# Altium schematic sheet Sheet1.SchDoc
size A3; DocumentNumber: 1; SheetNumber: 1; SheetTotal: 1
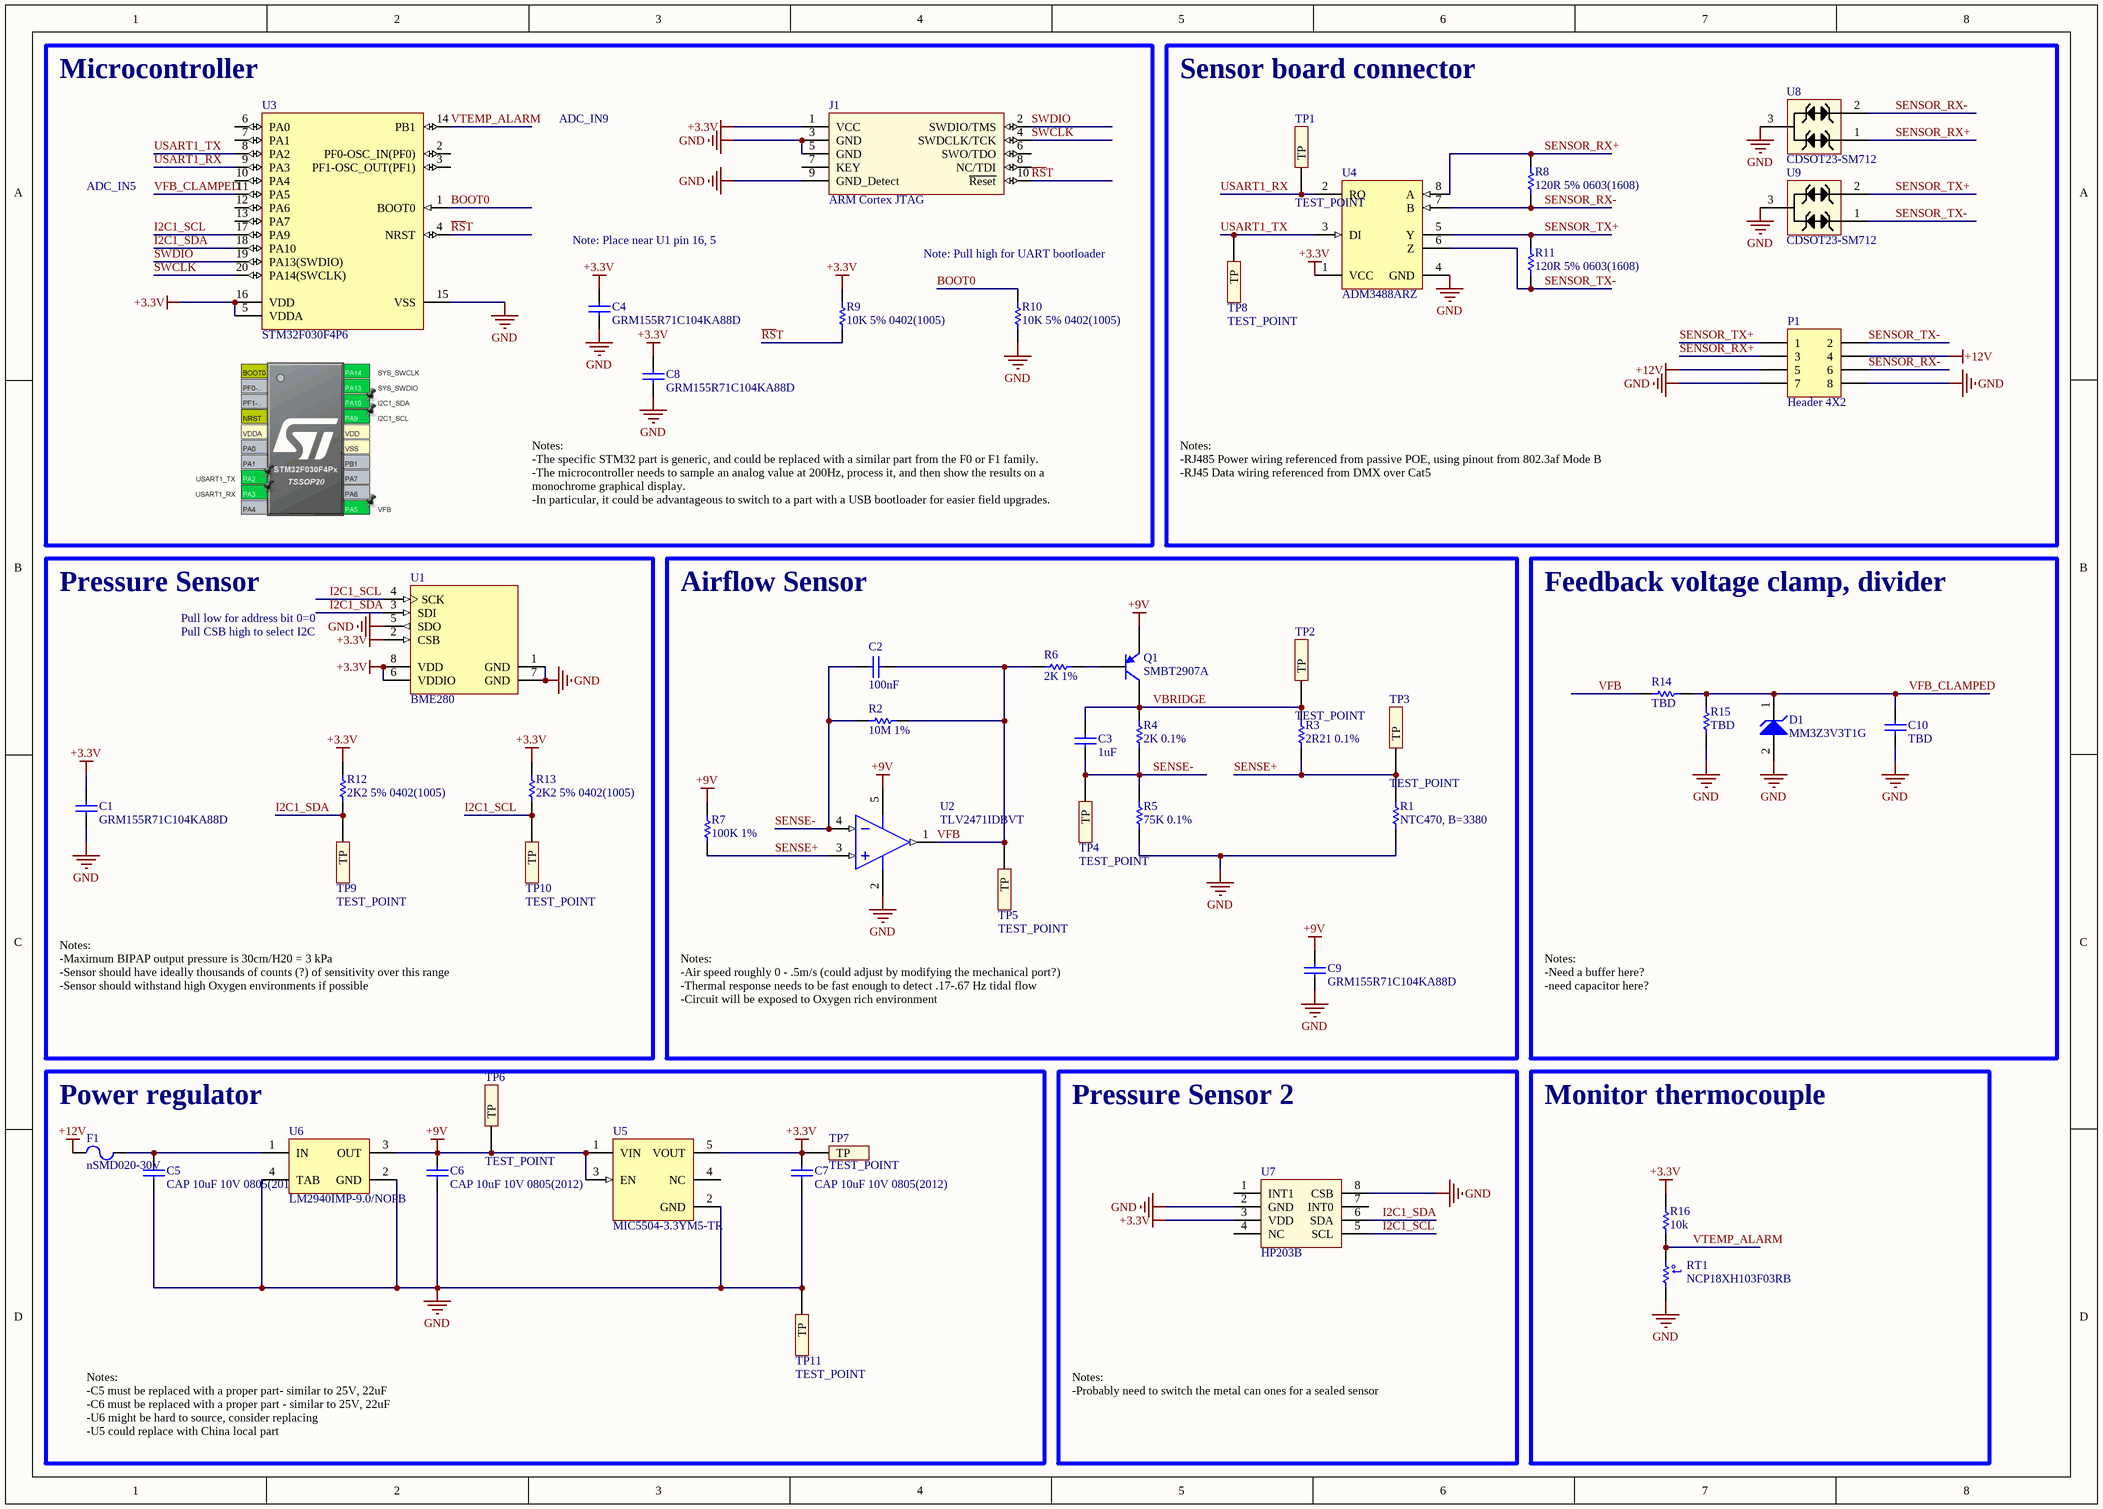
[diagram p0: Sheet1.SchDoc]

## Parts
C1  GRM155R71C104KA88D  [CAPC1005X55X25ML05T10]
C2  100nF  [CAPC1005X55X25ML05T10]
C3  1uF  [CAPC1005X55X25ML05T10]
C4  GRM155R71C104KA88D  [CAPC1005X55X25ML05T10]
C5  CAP 10uF 10V 0805(2012)  [CAPC0805(2012)145_N]
C6  CAP 10uF 10V 0805(2012)  [CAPC0805(2012)145_N]
C7  CAP 10uF 10V 0805(2012)  [CAPC0805(2012)145_N]
C8  GRM155R71C104KA88D  [CAPC1005X55X25ML05T10]
C9  GRM155R71C104KA88D  [CAPC1005X55X25ML05T10]
C10  TBD  [CAPC1005X55X25ML05T10]
D1  MM3Z3V3T1G  [ONSC-SOD-323-2-477-02_V]
F1  nSMD020-30V  [SEAANDLAND_1206]
J1  ARM Cortex JTAG  [1.27mm 2x5 SMD Header - no paste]
P1  Header 4X2  [HDR2X4]
Q1  SMBT2907A  [INF-SOT23_N]
R1  NTC470, B=3380  [RESC1005X40X25NL05T05]
R2  10M 1%  [RESC1005X40X25ML05T10]
R3  2R21 0.1%  [RESC1005X40X25ML05T10]
R4  2K 0.1%  [RESC1005X40X25ML05T10]
R5  75K 0.1%  [RESC1005X40X25ML05T10]
R6  2K 1%  [RESC1005X40X25NL05T05]
R7  100K 1%  [RESC1005X40X25ML05T10]
R8  120R 5% 0603(1608)  [RESC0603(1608)_L]
R9  10K 5% 0402(1005)  [RESC0402(1005)_N]
R10  10K 5% 0402(1005)  [RESC0402(1005)_N]
R11  120R 5% 0603(1608)  [RESC0603(1608)_L]
R12  2K2 5% 0402(1005)  [RESC0402(1005)_N]
R13  2K2 5% 0402(1005)  [RESC0402(1005)_N]
R14  TBD  [RESC1005X40X25ML05T10]
R15  TBD  [RESC1005X40X25ML05T10]
R16  10k  [RESC1005X40X25ML05T10]
RT1  NCP18XH103F03RB  [MURA-NCP18XH103F03RB-2_V]
TP1  TEST_POINT  [TP-SMD-1mm]  (no BOM)
TP2  TEST_POINT  [TP-SMD-1mm]  (no BOM)
TP3  TEST_POINT  [TP-SMD-1mm]  (no BOM)
TP4  TEST_POINT  [TP-SMD-1mm]  (no BOM)
TP5  TEST_POINT  [TP-SMD-1mm]  (no BOM)
TP6  TEST_POINT  [TP-SMD-1mm]  (no BOM)
TP7  TEST_POINT  [TP-SMD-1mm]  (no BOM)
TP8  TEST_POINT  [TP-SMD-1mm]  (no BOM)
TP9  TEST_POINT  [TP-SMD-1mm]  (no BOM)
TP10  TEST_POINT  [TP-SMD-1mm]  (no BOM)
TP11  TEST_POINT  [TP-SMD-1mm]  (no BOM)
U1  BME280  [BOSC-BME280-8_V]
U2  TLV2471IDBVT  [DBV0005A_L]
U3  STM32F030F4P6  [STM-TSSOP20_L]
U4  ADM3488ARZ  [ADI-R-8_L]
U5  MIC5504-3.3YM5-TR  [MCHP-SOT-23-M5_V]
U6  LM2940IMP-9.0/NOPB  [DCY0004A_L]
U7  HP203B  [HP203B]
U8  CDSOT23-SM712  [SOT95P230X117-3N]
U9  CDSOT23-SM712  [SOT95P230X117-3N]

## Blocks framed on the sheet
Microcontroller: C4 C8 J1 R9 R10 U3
Sensor board connector: P1 R8 R11 TP1 TP8 U4 U8 U9
Pressure Sensor: C1 R12 R13 TP9 TP10 U1
Airflow Sensor: C2 C3 C9 Q1 R1-R7 TP2-TP5 U2
Feedback voltage clamp, divider: C10 D1 R14 R15
Power regulator: C5-C7 F1 TP6 TP7 TP11 U5 U6
Pressure Sensor 2: U7
Monitor thermocouple: R16 RT1

## Nets
+3.3V: C1.2 C4.2 C7.2 C8.2 J1.1(VCC) R9.1 R12.2 R13.2 R16.1 TP7.1(TP) U1.2(CSB) U1.6(VDDIO) U1.8(VDD) U3.5(VDDA) U3.16(VDD) U4.1(VCC) U5.5(VOUT) U7.3(VDD)
+9V: C6.2 C9.2 Q1.2(E) R7.1 TP6.1(TP) U2.5(VDD) U5.1(VIN) U5.3(EN) U6.3(OUT)
+12V: F1.1 P1.4 P1.5
GND: C1.1 C4.1 C5.1 C6.1 C7.1 C8.1 C9.1 C10.2 D1.2(A) J1.3(GND) J1.5(GND) J1.9(GND_Detect) P1.7 P1.8 R1.1 R5.1 R10.2 R15.2 RT1.1 TP11.1(TP) U1.1(GND) U1.5(SDO) U1.7(GND) U2.2(GND) U3.15(VSS) U4.4(GND) U5.2(GND) U6.2(GND) U6.4(TAB) U7.2(GND) U7.8(CSB) U8.3 U9.3
~{RS}T: J1.10(~{Reset}) R9.2 U3.4(NRST)
BOOT0: R10.1 U3.1(BOOT0)
I2C1_SCL: R13.1 TP10.1(TP) U1.4(SCK) U3.17(PA9) U7.5(SCL)
I2C1_SDA: R12.1 TP9.1(TP) U1.3(SDI) U3.18(PA10) U7.6(SDA)
SENSE+: R1.2 R3.1 R7.2 TP3.1(TP) U2.3(IN+)
SENSE-: C2.2 C3.2 R2.2 R4.1 R5.2 TP4.1(TP) U2.4(IN-)
SENSOR_RX+: P1.3 R8.2 U4.8(A) U8.1
SENSOR_RX-: P1.6 R8.1 U4.7(B) U8.2
SENSOR_TX+: P1.1 R11.2 U4.5(Y) U9.2
SENSOR_TX-: P1.2 R11.1 U4.6(Z) U9.1
SWCLK: J1.4(SWDCLK/TCK) U3.20(PA14(SWCLK))
SWDIO: J1.2(SWDIO/TMS) U3.19(PA13(SWDIO))
USART1_RX: TP1.1(TP) U3.9(PA3) U4.2(RO)
USART1_TX: TP8.1(TP) U3.8(PA2) U4.3(DI)
VBRIDGE: C3.1 Q1.3(C) R3.2 R4.2 TP2.1(TP)
VFB: C2.1 R2.1 R6.2 R14.2 TP5.1(TP) U2.1(OUT)
VFB_CLAMPED: C10.1 D1.1(K) R14.1 R15.1 U3.11(PA5)
VTEMP_ALARM: R16.2 RT1.2 U3.14(PB1)
NetC5_2: C5.2 F1.2 U6.1(IN)
NetQ1_1: Q1.1(B) R6.1

Not connected (* = marked no-connect by the designer): J1 6(SWO/TDO) 7(KEY) 8(NC/TDI); U3 2(PF0-OSC_IN(PF0)) 3(PF1-OSC_OUT(PF1)) 6(PA0) 7(PA1) 10(PA4) 12(PA6) 13(PA7); U5 4(NC); U7 1(INT1) 4(NC) 7(INT0)

## Notes on the sheet
- ADC_IN9
- ADC_IN5
- Note: Place near U1 pin 16, 5
- (near R10) Note: Pull high for UART bootloader
- Notes:
  -The specific STM32 part is generic, and could be replaced with a similar part from the F0 or F1 family.
  -The microcontroller needs to sample an analog value at 200Hz, process it, and then show the results on a monochrome graphical display.
  -In particular, it could be advantageous to switch to a part with a USB bootloader for easier field upgrades.
- Notes:
  -RJ485 Power wiring referenced from passive POE, using pinout from 802.3af Mode B
  -RJ45 Data wiring referenced from DMX over Cat5
- Pull CSB high to select I2C
- Pull low for address bit 0=0
- Notes:
  -Maximum BIPAP output pressure is 30cm/H20 = 3 kPa
  -Sensor should have ideally thousands of counts (?) of sensitivity over this range
  -Sensor should withstand high Oxygen environments if possible
- Notes:
  -Air speed roughly 0 - .5m/s (could adjust by modifying the mechanical port?)
  -Thermal response needs to be fast enough to detect .17-.67 Hz tidal flow
  -Circuit will be exposed to Oxygen rich environment
- Notes:
  -Need a buffer here?
  -need capacitor here?
- Notes:
  -C5 must be replaced with a proper part- similar to 25V, 22uF
  -C6 must be replaced with a proper part - similar to 25V, 22uF
  -U6 might be hard to source, consider replacing
  -U5 could replace with China local part
- Notes:
  -Probably need to switch the metal can ones for a sealed sensor
- Title:
- Project:
- Revision:
- Date:
- Time:
- Sheet
- of
- (in symbol CMP-2000-05271-1) t°

## Library data of the parts
C1 C3 C4 C8-C10 = CMP-2100-03641-1: Chip Capacitor, 0.1 uF, +/- 10%, 16 V, -55 to 125 degC, 0402 (1005 Metric), RoHS, Tape and Reel; Manufacturer: Murata; Material: Ceramic; Insulation Resistance: 10GR; Voltage: 16V; Dielectric: X7R; Capacitance: 100nF; REACH SVHC: NoSVHC; Depth: 0.5mm; Case/Package: 0402; Datasheet URL: http://psearch.en.murata.com/capacitor/product/GRM155R71C104KA88%23.pdf; Lead Free: LeadFree; Dielectric Material: Ceramic; Manufacturer URL: http://www.murata.com/; Min Operating Temperature: -55degC; Length: 1mm; Case Code (Metric): 1005; Radiation Hardening: No; Package Reference: 0402; RoHSCompliant: true; Datasheet Version: 42675.0; Thickness: 0.022inch; Packaging: TapeandReel; Voltage Rating (DC): 16V; Tolerance: 10%; Max Operating Temperature: 125degC; Package Description: 2-Pin Surface Mount Device, Body 1 x 0.5 mm; Mount: SurfaceMount; Height: 0.5mm; Width: 0.5mm; Number of Pins: 2; Voltage Rating: 16V; Case Code (Imperial): 0402; Termination: SMD/SMT; Package Quantity: 1
C2 = CMP-2100-03641-1: Chip Capacitor, 0.1 uF, +/- 10%, 16 V, -55 to 125 degC, 0402 (1005 Metric), RoHS, Tape and Reel; Manufacturer: Murata; Material: Ceramic; Insulation Resistance: 10GR; Voltage: 16V; Dielectric: X7R; REACH SVHC: NoSVHC; Depth: 0.5mm; Case/Package: 0402; Datasheet URL: http://psearch.en.murata.com/capacitor/product/GRM155R71C104KA88%23.pdf; Lead Free: LeadFree; Dielectric Material: Ceramic; Manufacturer URL: http://www.murata.com/; Min Operating Temperature: -55degC; Length: 1mm; Case Code (Metric): 1005; Radiation Hardening: No; Package Reference: 0402; RoHSCompliant: true; Datasheet Version: 42675.0; Thickness: 0.022inch; Packaging: TapeandReel; Voltage Rating (DC): 16V; Tolerance: 10%; Max Operating Temperature: 125degC; Package Description: 2-Pin Surface Mount Device, Body 1 x 0.5 mm; Mount: SurfaceMount; Height: 0.5mm; Width: 0.5mm; Number of Pins: 2; Voltage Rating: 16V; Case Code (Imperial): 0402; Termination: SMD/SMT; Capacitance: 100nF; Package Quantity: 1
C5-C7 = CMP-1036-04922-1: CAP 10uF 10V ±10% 0805 (2012 Metric) Thickness 1.45mm SMD; Tolerance: Â±10%; Case-EIA: 0805; Case-Metric: 2012; Value: 10uF; Technology: SMT; Rated Voltage: 10 V; Max Thickness: 1.45 mm
D1 = CMP-1060-00672-1: Zener Voltage Regulator, 300 mW, 2-Pin SOD-323, Pb-Free, Tape and Reel; Manufacturer: On Semiconductor; VZ Typ (V): 3.3; P Max (W): 0.3; ComponentLink1URL: http://www.onsemi.com/; ComponentLink2Description: Datasheet; PackageVersion: Rev. H, 03/2007; PartNumber: MM3Z3V3T1G; PackageReference: SOD-323-2-477-02; ComponentLink1Description: Manufacturer URL; PackageDescription: 2-Pin SOD, Body 1.7 x 1.25 mm; RoHS: Pb-Free; ComponentLink3Description: Package Specification; Packing: Tape and Reel; DatasheetVersion: Rev. 9; ComponentLink3URL: http://www.onsemi.com/pub_link/Collateral/477-02.PDF.1; Mounting Technology: Surface Mount; ComponentLink2URL: http://www.onsemi.cn/pub_link/Collateral/MM3Z2V4T1-D.PDF
F1 = nSMD020-30V: Surface Mount Fuses 30V 100A 200mA 460mA 1206 RoHS; Manufacturer: Sea & Land Electronic Corp; PartNumber: NSMD020-30V; ComponentLink2Description: Datasheet; ComponentLink2URL: nSMD020-30V 0-2A-30V-Self-healing-fuse_C69680.pdf
J1 = ARM Cortex JTAG: Arm Cortex 10-pin JTAG connector; Manufacturer: Unknown/Generic; PartNumber: unknown/Generic
P1 = Header 4X2: Header, 4-Pin, Dual row; LatestRevisionDate: 17-Jul-2002; LatestRevisionNote: Re-released for DXP Platform.; Publisher: Altium Limited
Q1 = CMP-1178-00003-1: PNP Silicon Switching Transistor, 60 V VCEO, 600 mA IC, SOT23, Reel, Green; Manufacturer: Infineon; VCBO (max): 60 V; VCE: 10 V; IC: 150 mA; IC (max): 600 mA; Green: TRUE; VEBO (max): 5 V; ICBO (max): 10 nA; Polarity: PNP; VCEO (max): 60 V; VCE (max): 10 V; PackageDescription: 3-Pin Small Outline Transistor Package, 1.3 x 2.9 mm Body, 0.95 mm Pitch; ComponentLink1Description: Manufacturer URL; ComponentLink2Description: Datasheet; ComponentLink2URL: http://www.infineon.com/dgdl/smbt2907a.pdf?folderId=db3a30431441fb5d011445fab851018e&fileId=db3a30431441fb5d011445fe084a0190; Mounting Technology: Surface Mount; ComponentLink3Description: Package Specification; PartNumber: SMBT2907A; Packing: Reel; ComponentLink3URL: http://www.infineon.com/dgdl/SOT23-Package_Overview.pdf?folderId=db3a30431936bc4b0119532290053c66&fileId=db3a30431936bc4b0119533468123c85; PackageReference: SOT23; PackageVersion: Apr-08; ComponentLink1URL: http://www.infineon.com/
R1 R6 = CMP-2002-01187-1: Manufacturer: Panasonic; Part Number: ERT-J0EV474J
R2-R5 R7 R14-R16 = CMP-2002-07472-1: Part Number: RC0402FR-071KL; Manufacturer: Yageo / Phycomp
R8 R11 = CMP-1012-00052-1: 120R 0.1W 5% 0603 (1608 Metric)  SMD; Case-EIA: 0603; Value: 120.00 Ohm; Case-Metric: 1608; Technology: SMT; Power: 0.1 W; Tolerance: 5 %
R9 R10 = CMP-1011-00098-1: 10K 0.063W 5% 0402 (1005 Metric)  SMD; Case-Metric: 1005; Value: 10000.00 Ohm; Case-EIA: 0402; Technology: SMT; Tolerance: 5 %; Power: 0.063 W
R12 R13 = CMP-1011-00082-1: 2K2 0.063W 5% 0402 (1005 Metric)  SMD; Value: 2200.00 Ohm; Case-EIA: 0402; Case-Metric: 1005; Tolerance: 5 %; Power: 0.063 W; Technology: SMT
RT1 = CMP-2000-05271-1: NTC Thermistor, 10 KOhm, +/- 1%, 0.1 W, -40 to 125 degC, 0603 (1608 Metric), RoHS, Tape and Reel; Manufacturer: Murata; B-constant: 3434K; Resistance: 10kO; Rated Current: 310A; Datasheet URL: http://www.jameco.com/Jameco/Products/ProdDS/1870999.pdf; Datasheet Version: Apr-05; Temperature Range: -40to+125degC; Tolerance (%): ±1%; Manufacturer URL: http://www.murata.com/; Type: NTC
TP1-TP11 = TEST_POINT: Test point
U1 = CMP-2000-05073-1: Combined Humidity and Pressure Sensor, 1.71 to 3.6 V, -40 to 85 degC, 8-Pin SMD, RoHS, Tape and Reel; Manufacturer: Bosch Sensortec; Datasheet Version: Rev. 1.2, 10/2015; Datasheet URL: http://datasheet.octopart.com/BME280-Bosch-datasheet-58577763.pdf; Manufacturer URL: http://www.bosch-sensortec.com
U2 = CMP-0271-00230-3: Single Low-Power Rail-to-Rail Input / Output Operational Amplifier, 2.7 to 6 V, -40 to 125 degC, 5-pin SOT23 (DBV5), Green (RoHS & no Sb/Br); Manufacturer: Texas Instruments; Number of Channels: 1; Vio (25C)(Max)(mV): 2.2; Total Supply Voltage(Max)(+5V is 5, +/-5V is 10): 6; CMRR(Min)(dB): 61; Total Supply Voltage(Min)(+5V is 5, +/-5V is 10): 2.7; Iq per channel(Max)(mA): 0.75; Sub Family: Low Supply Voltage Amplifier (<=2.7V), Precision Amplifier; Offset Drift(Typ)(uV/C): 0.4; Slew Rate(Typ)(V/us): 1.4; IIB(Max)(pA): 50; Vn at 1kHz(Typ)(nV/rtHz): 15; Code_JEDEC: MO-178; ComponentLink1Description: Manufacturer URL; PackageVersion: 4073253-4/K, 03/2006; Eco-Plan: Green (RoHS & no Sb/Br); PackageReference: DBV0005A; ComponentLink2URL: http://www.ti.com/general/docs/lit/getliterature.tsp?genericPartNumber=TLV2471&fileType=pdf; DatasheetVersion: SLOS232E; ComponentLink3Description: Package Specification; Mounting Technology: Surface Mount; PartNumber: TLV2471IDBVT; PackageDescription: 5-Pin Plastic Small Outline, Body 1.6 x 2.9 mm, Pitch 0.95 mm; ComponentLink1URL: http://www.ti.com/; ComponentLink3URL: http://www.ti.com/litv/pdf/mpds018i; ComponentLink2Description: Datasheet
U3 = CMP-0304-00039-2: ARM Cortex-M0 32-bit MCU, 16 KB Flash, 4 KB Internal RAM, 15 I/Os, 20-pin TSSOP, -40 to 85 degC, Tube; I/Os (High Current): 15; FLASH Size (Prog) (kB): 16; Internal RAM Size (kB): 4; Supply Voltage(Vcc) min (V): 2.4; Operating Frequency(F) (Processor speed) (MHz): 48; ComponentLink2URL: http://www.st.com/st-web-ui/static/active/en/resource/technical/document/datasheet/DM00088500.pdf; Core: ARM Cortex-M0; ComponentLink2Description: Datasheet; PackageDescription: 20-Pin Thin Shrink Small Outline Package, 6.5 x 4.4 mm Body, 0.65 mm Pitch; Mounting Technology: Surface Mount; ComponentLink1URL: http://www.st.com/web/en/home.html; PackageVersion: Rev. 1, 11/2012; ComponentLink3Description: Package Specification; PartNumber: STM32F030F4P6; ComponentLink3URL: http://www.st.com/st-web-ui/static/active/en/resource/technical/document/datasheet/DM00065136.pdf; DatasheetVersion: Rev. 1; PackageReference: TSSOP20; ComponentLink1Description: Manufacturer URL; Packing: Tube
U4 = CMP-0535-00058-1: 3.3 V Slew Rate Limited, Full-Duplex, RS-485/RS-422 Transceivers, 3 to 3.6 V, -40 to 85 degC, 8-Pin SOIC (R-8), RoHS, Tube; Manufacturer: Analog Devices; Guaranteed Data Rate: 0.25 Mbps; Receiver Hysteresis: 50 mV; Number of Drivers: 1; Duplex: Full; ComponentLink2URL: http://www.analog.com/static/imported-files/data_sheets/ADM3483_3485_3488_3490_3491.pdf; Mounting Technology: Surface Mount; RoHS: TRUE; ComponentLink2Description: Datasheet; ComponentLink3URL: http://www.analog.com/media/en/package-pcb-resources/package/pkg_pdf/soic_narrow-r/r_8.pdf; ComponentLink3Description: Package Specification; DatasheetVersion: Rev. E; PackageDescription: 8-Pin Standard Small Outline Package, Body 4.9 x 3.9 mm, Pitch 1.27 mm; ComponentLink1Description: Manufacturer URL; Supply Voltage: 3 to 3.6 V; PackageVersion: 06/2006; PartNumber: ADM3488ARZ; Packing: Tube; ComponentLink1URL: http://www.analog.com/en/index.html; Temperature Range: -40 to 85 degC
U5 = CMP-2000-07604-1: Single LDO, 2.5 to 5.5 V, Fixed Out 3.3 V, 0.3 A, -40 to 125 degC, 5-Pin SOT-23 (M5), RoHS, Tape and Reel; Manufacturer: Microchip; Number of Regulators: 1; Dropout Voltage: 160mV; Output Current: 300mA; Min Input Voltage: 2.5V; Nominal Output Voltage: 3.3V; Max Input Voltage: 5.5V; Min Current Limit: 400mA; Number of Pins: 5; RoHSCompliant: True; Min Operating Temperature: -40degC; Case\/Package: SOT-23; Datasheet URL: http://ww1.microchip.com/downloads/en/DeviceDoc/MIC550X.pdf; Package Description: 5-Pin Small Outline Transistor, Body 1.6 x 2.9 mm, Pitch 0.95 mm; Max Operating Temperature: 125degC; Packaging: CutTape; Manufacturer URL: http://www.microchip.com/; Package Reference: SOT-23; Mount: SurfaceMount; Output Voltage: 3.3V; Mounting Technology: SurfaceMount; Lead Free: LeadFree; REACH SVHC: NoSVHC; Datasheet Version: Rev. 2.3, 04/2015
U6 = CMP-0062-01727-3: 1A Low Dropout Regulator, 4-pin SOT-223, Pb-Free; Manufacturer: Texas Instruments; PackageTopMarking: XYTT*L0EB; PowerWise: N; CompType: LDO IC; PinCount: 4; ComponentLink1Description: Datasheet URL; ComponentLink1URL: http://www.ti.com/general/docs/lit/getliterature.tsp?genericPartNumber=LM2940-N&fileType=pdf; PackageReference: DCY0004A; Code_IPC: SOT223-4; RoHS: Y; Code_JEDEC: TO-261-AA; PackageDescription: Molded SOT-223, 6.50 x 3.56 x 1.6mm Body, 4 Lead, 2.3mm Pitch
U7 = HP203B: PRECISION BAROMETER AND ALTIMETER SENSOR; Manufacturer: HopeRF; PartNumber: HP203B
U8 U9 = CDSOT23-SM712: 600 WATT TVS ARRAY - ASYMMETRICAL DATA LINE PROTECTOR; Manufacturer: Bourns; ComponentLink2Description: Datasheet; ComponentLink2URL: Bourns CDSOT23-SM712.pdf; PartNumber: CDSOT23-SM712